# EAGLE design hbridge (EAGLE 6.4)
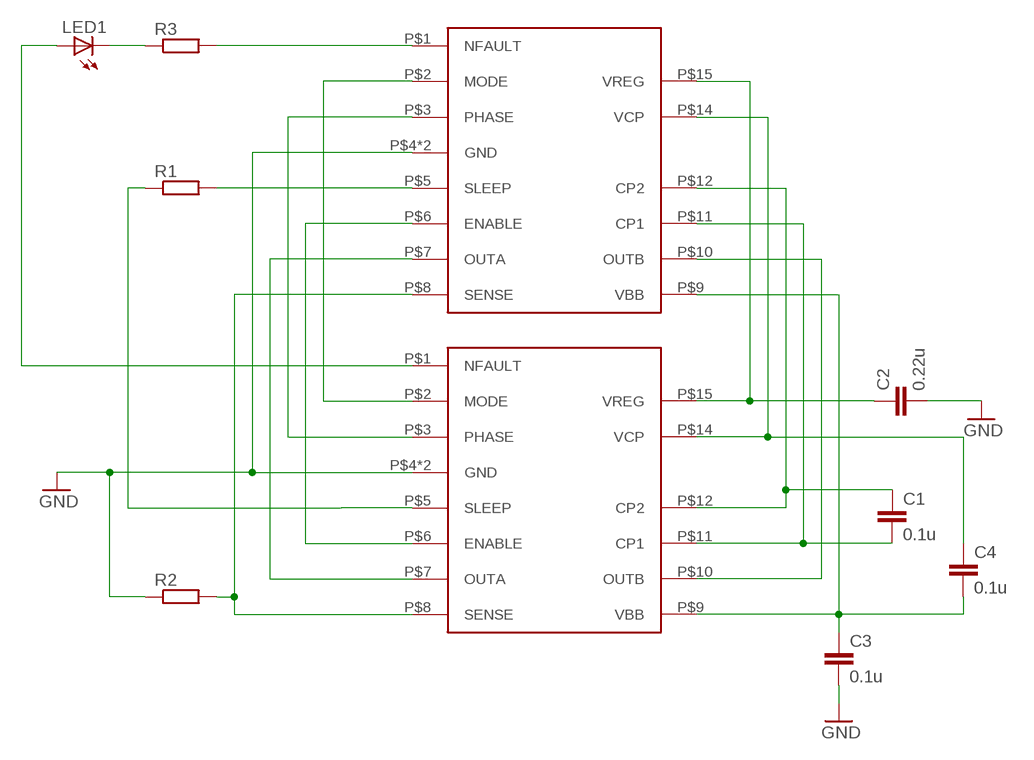
[diagram p0: schematic, sheet 1]

## Parts
C1  0.1u  C-EUC0603  [C0603]
C2  0.22u  C-EUC0603  [C0603]
C3  0.1u  C-EUC0603  [C0603]
C4  0.1u  C-EUC0603  [C0603]
LED1  LED3MM  [LED3MM]
R1  R-EU_R0603  [R0603]
R2  R-EU_R0603  [R0603]
R3  R-EU_R0603  [R0603]
U$1  A3950  [16TSSOP]
U$2  A3950-DIL  [DIL16]

## Nets
GND: C2.2 C3.2 R2.1 U$1.P$4(GND) U$1.P$13(GND) U$2.P$4(GND) U$2.P$13(GND)
N$1: LED1.A U$2.P$1(NFAULT)
N$5: U$1.P$2(MODE) U$2.P$2(MODE)
N$6: U$1.P$3(PHASE) U$2.P$3(PHASE)
N$7: R1.2 U$1.P$5(SLEEP)
N$8: U$1.P$6(ENABLE) U$2.P$6(ENABLE)
N$9: U$1.P$7(OUTA) U$2.P$7(OUTA)
N$10: R2.2 U$1.P$8(SENSE) U$2.P$8(SENSE)
N$11: C2.1 U$1.P$15(VREG) U$2.P$15(VREG)
N$12: C4.1 U$1.P$14(VCP) U$2.P$14(VCP)
N$13: R1.1 U$2.P$5(SLEEP)
N$14: C1.1 U$1.P$12(CP2) U$2.P$12(CP2)
N$15: C1.2 U$1.P$11(CP1) U$2.P$11(CP1)
N$16: U$1.P$10(OUTB) U$2.P$10(OUTB)
N$17: C3.1 C4.2 U$1.P$9(VBB) U$2.P$9(VBB)
N$18: LED1.K(C) R3.1
N$19: R3.2 U$1.P$1(NFAULT)

## Library data of the parts
C1-C4 = rcl:C-EU: CAPACITOR, European symbol
LED1 = led:LED: LED OSRAM: - CHIPLED LG R971, LG N971, LY N971, LG Q971, LY Q971, LO R971, LY R971 LH N974, LH R974 LS Q976, LO Q976, LY Q976 LO Q996 - Hyper CHIPLED LW Q18S LB Q993, LB Q99A, LB R99A - SideLED LS A670, LO A670, LY A670, LG A670, LP A670 LB A673, LV A673, LT A673, LW A673 LH A674 LY A675 LS A676, LA A676, LO A676, LY A676, LW A676 LS A679, LY A679, LG A679 - Hyper Micro SIDELED® LS Y876, LA Y876, LO Y876, LY Y876 LT Y87S - SmartLED LW L88C, LW L88S LB L89C, LB L89S, LG L890 LS L89K, LO L89K, LY L89K LS L896, LA L896, LO L896, LY L896 - TOPLED LS T670, LO T670, LY T670, LG T670, LP T670 LSG T670, LSP T670, LSY T670, LOP T670, LYG T670 LG T671, LOG T671, LSG T671 LB T673, LV T673, LT T673, LW T673 LH T674 LS T676, LA T676, LO T676, LY T676, LB T676, LH T676, LSB T676, LW T676 LB T67C, LV T67C, LT T67C, LS T67K, LO T67K, LY T67K, LW E67C LS E67B, LA E67B, LO E67B, LY E67B, LB E67C, LV E67C, LT E67C LW T67C LS T679, LY T679, LG T679 LS T770, LO T770, LY T770, LG T770, LP T770 LB T773, LV T773, LT T773, LW T773 LH T774 LS E675, LA E675, LY E675, LS T675 LS T776, LA T776, LO T776, LY T776, LB T776 LHGB T686 LT T68C, LB T68C - Hyper Mini TOPLED® LB M676 - Mini TOPLED Santana® LG M470 LS M47K, LO M47K, LY M47K Source: http://www.osram.convergy.de LUXEON: - LUMILED® LXK2-PW12-R00, LXK2-PW12-S00, LXK2-PW14-U00, LXK2-PW14-V00 LXK2-PM12-R00, LXK2-PM12-S00, LXK2-PM14-U00 LXK2-PE12-Q00, LXK2-PE12-R00, LXK2-PE12-S00, LXK2-PE14-T00, LXK2-PE14-U00 LXK2-PB12-K00, LXK2-PB12-L00, LXK2-PB12-M00, LXK2-PB14-N00, LXK2-PB14-P00, LXK2-PB14-Q00 LXK2-PR12-L00, LXK2-PR12-M00, LXK2-PR14-Q00, LXK2-PR14-R00 LXK2-PD12-Q00, LXK2-PD12-R00, LXK2-PD12-S00 LXK2-PH12-R00, LXK2-PH12-S00 LXK2-PL12-P00, LXK2-PL12-Q00, LXK2-PL12-R00 Source: www.luxeon.com KINGBRIGHT: KA-3528ASYC Source: www.kingbright.com
R1-R3 = rcl:R-EU_: RESISTOR, European symbol
U$1 = A3950:A3950
U$2 = A3950:A3950-DIL

## Net classes
0 default: clearance 0.355 mm

## Board
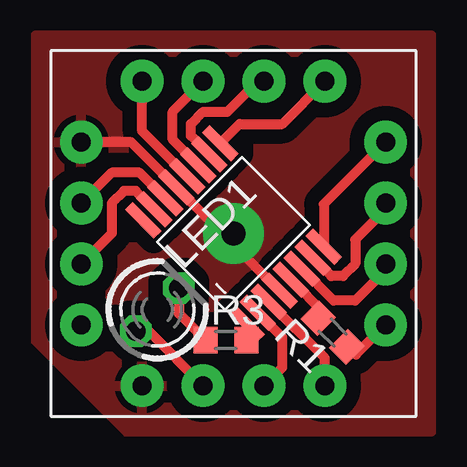
[diagram p1: board, top side]
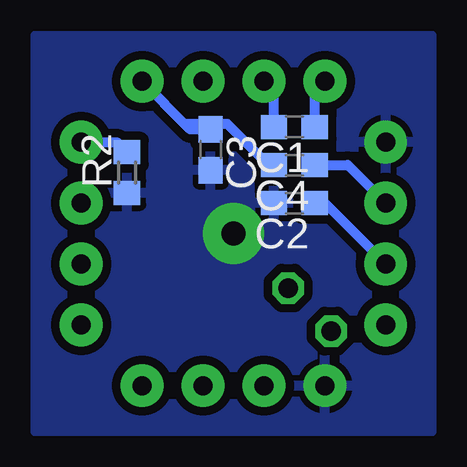
[diagram p2: board, bottom side, seen from below]

No outline drawn. Coordinates in mm, seen from the top.
Copper layers (1*16): Top 0.035mm / dielectric 1.5mm / Bottom 0.035mm
Design rules "SeeedStudio_DRU_no_angle_2layer": minimum track width 6mil, minimum drill 12mil, track to track 6mil, track to pad 6mil, pad to pad 6mil, via to via 6mil, smd to smd 0mil, copper to edge 10mil, drill to drill 10mil, minimum pad ring 10mil, minimum via ring 6mil, stop-mask expansion 2mil, vias tented up to drill 25mil, thermal gap 10mil

### Footprints (pad centres in the part's own frame; a part is rotated, then mirrored left to right if it is on the bottom)
C0603 = smd 1.1 x 1: 1 -0.85,0; 2 0.85,0
LED3MM = drill 0.813 octagon: A -1.27,0; K 1.27,0
R0603 = smd 1 x 1.1: 1 -0.85,0; 2 0.85,0
16TSSOP = smd 0.45 x 1.7: P$1 -2.275,-3.05; P$2 -1.625,-3.05; P$3 -0.975,-3.05; P$4 -0.325,-3.05; P$5 0.325,-3.05; P$6 0.975,-3.05; P$7 1.625,-3.05; P$8 2.275,-3.05; P$9 2.275,3.05; P$10 1.625,3.05; P$11 0.975,3.05; P$12 0.325,3.05; P$13 -0.325,3.05; P$14 -0.975,3.05; P$15 -1.625,3.05; P$16 -2.275,3.05
DIL16 = drill 0.8 pad 1.778: P$1 -1.27,-6.35; P$2 1.27,-6.35; P$3 3.81,-6.35; P$4 -3.81,-6.35; P$5 6.35,-3.81; P$6 6.35,-1.27; P$7 6.35,1.27; P$8 6.35,3.81; P$9 3.81,6.35; P$10 1.27,6.35; P$11 -1.27,6.35; P$12 -3.81,6.35; P$13 -6.35,3.81; P$14 -6.35,1.27; P$15 -6.35,-1.27; P$16 -6.35,-3.81

### Placement (x,y rotation side)
C1  5.08,12.06 180 bottom
C2  5.08,8.89 180 bottom
C3  8.57,11.11 270 bottom
C4  5.08,10.48 180 bottom
LED1  4.45,4.45 45 top
R1  11.75,3.49 135 top
R2  12.06,10.16 90 bottom
R3  7.3,3.17 0 top
U$1  7.62,7.62 45 top
U$2  7.62,7.62 0 top

### Tracks (layer width: path | path; a pad name or v marks a point on that pad's centre or on a via)
GND  (via drill 1 pad 2.54)
  Top 0.406: U$2.P$13 3.35,11.43 U$1.P$13 U$1.P$4
  other vias: 7.62,7.62
  pour Top (isolate 0.61): -0.64,15.88 -0.64,-0.64 15.88,-0.64 15.88,15.88
  pour Bottom: -0.64,15.88 -0.64,-0.64 15.88,-0.64 15.88,15.88
N$1
  Top 0.406: 6.6,1.27 U$2.P$1 4.07,3.55 LED1.A
N$5
  Top 0.406: U$2.P$2 9.65,2.03 9.65,3.29 U$1.P$2
N$6
  Top 0.406: U$2.P$3 11.43,2.43 U$1.P$3
N$7
  Top 0.406: R1.2 11.46,4.24 U$1.P$5
N$8
  Top 0.406: U$2.P$6 13.97,6.1 12.7,4.83 11.79,4.83 U$1.P$6
N$9
  Top 0.406: U$2.P$7 13.97,8.64 12.7,7.37 12.7,6.35 12.19,5.84 11.7,5.84 U$1.P$7
N$10
  Top 0.406: U$2.P$8 11.38,8.85 U$1.P$8
  Bottom 0.406: U$2.P$8 12.48,11.43 R2.2
N$11
  Top 0.406: U$1.P$15 3.54,9.4 3.05,9.4 2.54,8.89 2.54,7.62 U$2.P$15
  Bottom 0.406: C2.1 3.81,8.89 U$2.P$15
N$12
  Top 0.406: U$1.P$14 3.7,10.16 2.54,10.16 U$2.P$14
  Bottom 0.406: C4.1 2.86,10.48 U$2.P$14
N$13
  Top 0.406: R1.1 12.73,2.57 U$2.P$5
N$14
  Top 0.406: U$1.P$12 3.81,11.89 U$2.P$12
  Bottom 0.406: C1.1 4.23,13.55 U$2.P$12
N$15
  Top 0.406: U$1.P$11 5.08,11.54 5.08,12.7 U$2.P$11
  Bottom 0.406: C1.2 5.93,13.55 U$2.P$11
N$16
  Top 0.406: U$1.P$10 5.84,11.7 5.84,12.19 6.35,12.7 7.37,12.7 8.64,13.97 U$2.P$10
N$17
  Top 0.406: U$1.P$9 7.88,12.19 9.65,12.19 U$2.P$9
  Bottom 0.406: C4.2 6.16,10.48 7.88,12.19 9.65,12.19 U$2.P$9 9.42,11.96 C3.1
N$18
  Top 0.406: LED1.K 5.34,4.28 R3.1
N$19
  Top 0.406: U$1.P$1 8.17,3.19 R3.2

### Text on the board
_tNames: C4 | IC1 | R1 | C1 | IC2 | C3 | R2 | C2 | JP1